# EAGLE design controller (EAGLE 9.6.2)
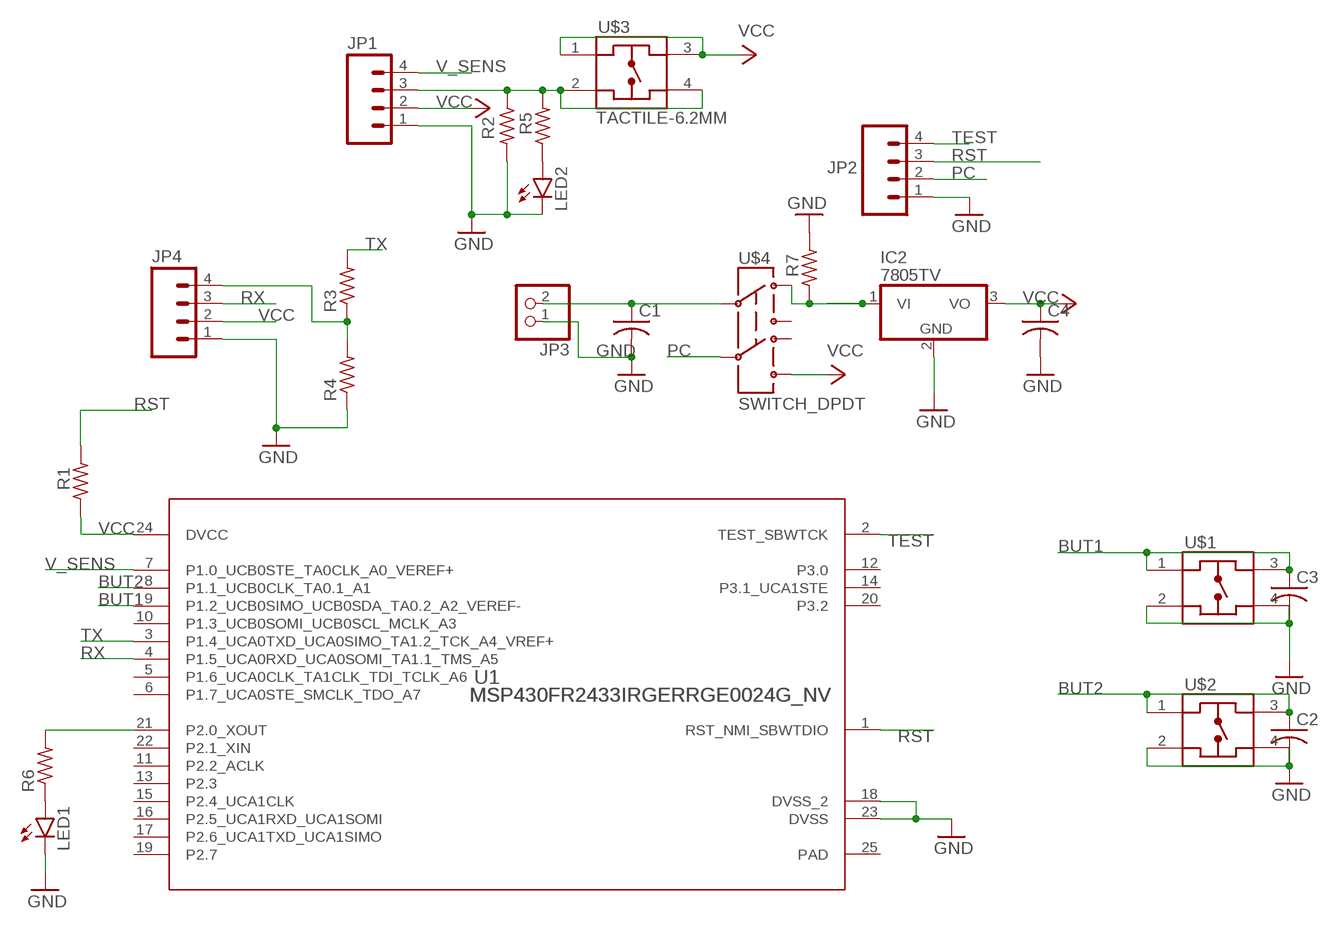
[diagram p0: schematic, sheet 1]

## Parts
C1  C-USC1206  [C1206]
C2  C-USC0603  [C0603]
C3  C-USC0603  [C0603]
C4  C-USC1206  [C1206]
IC2  7805TV  [TO220V]
JP1  HEADER_1X04LOCK  [1X04_LOCK]
JP2  HEADER_1X04LOCK  [1X04_LOCK]
JP3  PINHD-1X2  [1X02]
JP4  HEADER_1X04LOCK  [1X04_LOCK]
LED1  LED5MM  [LED5MM]
LED2  LED5MM  [LED5MM]
R1  R-US_R1206  [R1206]
R2  R-US_R1206  [R1206]
R3  R-US_R1206  [R1206]
R4  R-US_R1206  [R1206]
R5  R-US_R1206  [R1206]
R6  R-US_R1206  [R1206]
R7  R-US_R1206  [R1206]
U1  MSP430FR2433IRGERRGE0024G_NV  [RGE0024G_NV]
U$1  TACTILE-6.2MM  [222_AM]
U$2  TACTILE-6.2MM  [222_AM]
U$3  TACTILE-6.2MM  [222_AM]
U$4  SWITCH_DPDT  [JS_DPDT_TH]

## Nets
BUT1: C3.1 U1.9(P1.2_UCB0SIMO_UCB0SDA_TA0.2_A2_VEREF-) U$1.1 U$1.3
BUT2: C2.1 U1.8(P1.1_UCB0CLK_TA0.1_A1) U$2.1 U$2.3
GND: C1.2 C2.2 C3.2 C4.2 IC2.2(GND) JP1.1 JP2.1 JP3.1 JP4.1 LED1.K(C) LED2.K(C) R2.2 R4.1 R7.2 U1.18(DVSS_2) U1.23(DVSS) U$1.2 U$1.4 U$2.2 U$2.4
N$1: IC2.1(VI) R7.1 U$4.1
N$2: R6.2 U1.21(P2.0_XOUT)
N$3: C1.1 JP3.2 U$4.2
N$4: JP1.3 R2.1 R5.2 U$3.2 U$3.4
N$7: LED1.A R6.1
N$8: JP4.4 R3.1 R4.2
N$9: LED2.A R5.1
PC: JP2.2 U$4.5
RST: JP2.3 R1.2 U1.1(RST_NMI_SBWTDIO)
RX: JP4.3 U1.4(P1.5_UCA0RXD_UCA0SOMI_TA1.1_TMS_A5)
TEST: JP2.4 U1.2(TEST_SBWTCK)
TX: R3.2 U1.3(P1.4_UCA0TXD_UCA0SIMO_TA1.2_TCK_A4_VREF+)
V_SENS: JP1.4 U1.7(P1.0_UCB0STE_TA0CLK_A0_VEREF+)
VCC: C4.1 IC2.3(VO) JP1.2 JP4.2 R1.1 U1.24(DVCC) U$3.1 U$3.3 U$4.6
Unconnected: U1.5(P1.6_UCA0CLK_TA1CLK_TDI_TCLK_A6) U1.6(P1.7_UCA0STE_SMCLK_TDO_A7) U1.10(P1.3_UCB0SOMI_UCB0SCL_MCLK_A3) U1.11(P2.2_ACLK) U1.12(P3.0) U1.13(P2.3) U1.14(P3.1_UCA1STE) U1.15(P2.4_UCA1CLK) U1.16(P2.5_UCA1RXD_UCA1SOMI) U1.17(P2.6_UCA1TXD_UCA1SIMO) U1.19(P2.7) U1.20(P3.2) U1.22(P2.1_XIN) U$4.3 U$4.4

## Power pins joined to a net without a drawn wire
PAD: U1.25(PAD)

## Library data of the parts
C1-C4 = rcl:C-US: CAPACITOR, American symbol; SPICEPREFIX: C
IC2 = linear:78*: Positive VOLTAGE REGULATOR Source: http://cache.national.com/ds/LM/LM78L05.pdf http://www.fairchildsemi.com/ds/LM/LM7805.pdf
JP1 JP2 JP4 = ELEC327:HEADER_1X04: Header 4 Standard 4-pin 0.1" header. Use with straight break away headers (SKU : PRT-00116), right angle break away headers (PRT-00553), swiss pins (PRT-00743), machine pins (PRT-00117), and female headers (PRT-00115). Molex polarized connector foot print use with SKU : PRT-08231 with associated crimp pins and housings.
JP3 = pinhead:PINHD-1X2: PIN HEADER
LED1 LED2 = led:LED: LED OSRAM: - CHIPLED LG R971, LG N971, LY N971, LG Q971, LY Q971, LO R971, LY R971 LH N974, LH R974 LS Q976, LO Q976, LY Q976 LO Q996 - Hyper CHIPLED LW Q18S LB Q993, LB Q99A, LB R99A - SideLED LS A670, LO A670, LY A670, LG A670, LP A670 LB A673, LV A673, LT A673, LW A673 LH A674 LY A675 LS A676, LA A676, LO A676, LY A676, LW A676 LS A679, LY A679, LG A679 - Hyper Micro SIDELED® LS Y876, LA Y876, LO Y876, LY Y876 LT Y87S - SmartLED LW L88C, LW L88S LB L89C, LB L89S, LG L890 LS L89K, LO L89K, LY L89K LS L896, LA L896, LO L896, LY L896 - TOPLED LS T670, LO T670, LY T670, LG T670, LP T670 LSG T670, LSP T670, LSY T670, LOP T670, LYG T670 LG T671, LOG T671, LSG T671 LB T673, LV T673, LT T673, LW T673 LH T674 LS T676, LA T676, LO T676, LY T676, LB T676, LH T676, LSB T676, LW T676 LB T67C, LV T67C, LT T67C, LS T67K, LO T67K, LY T67K, LW E67C LS E67B, LA E67B, LO E67B, LY E67B, LB E67C, LV E67C, LT E67C LW T67C LS T679, LY T679, LG T679 LS T770, LO T770, LY T770, LG T770, LP T770 LB T773, LV T773, LT T773, LW T773 LH T774 LS E675, LA E675, LY E675, LS T675 LS T776, LA T776, LO T776, LY T776, LB T776 LHGB T686 LT T68C, LB T68C - Hyper Mini TOPLED® LB M676 - Mini TOPLED Santana® LG M470 LS M47K, LO M47K, LY M47K Source: http://www.osram.convergy.de LUXEON: - LUMILED® LXK2-PW12-R00, LXK2-PW12-S00, LXK2-PW14-U00, LXK2-PW14-V00 LXK2-PM12-R00, LXK2-PM12-S00, LXK2-PM14-U00 LXK2-PE12-Q00, LXK2-PE12-R00, LXK2-PE12-S00, LXK2-PE14-T00, LXK2-PE14-U00 LXK2-PB12-K00, LXK2-PB12-L00, LXK2-PB12-M00, LXK2-PB14-N00, LXK2-PB14-P00, LXK2-PB14-Q00 LXK2-PR12-L00, LXK2-PR12-M00, LXK2-PR14-Q00, LXK2-PR14-R00 LXK2-PD12-Q00, LXK2-PD12-R00, LXK2-PD12-S00 LXK2-PH12-R00, LXK2-PH12-S00 LXK2-PL12-P00, LXK2-PL12-Q00, LXK2-PL12-R00 Source: www.luxeon.com KINGBRIGHT: KA-3528ASYC Source: www.kingbright.com
R1-R7 = rcl:R-US_: RESISTOR, American symbol; SPICEPREFIX: R
U1 = msp430fr2433:MSP430FR2433IRGER; COPYRIGHT: Copyright (C) 2023 Ultra Librarian. All rights reserved.; MANUFACTURER_PART_NUMBER: MSP430FR2433IRGER; MFR_NAME: Texas Instruments; REFDES: RefDes; TYPE: TYPE
U$1-U$3 = ELEC327:TACTILE-6.2MM: CTS 6.2 x 6.2 mm Tactile Switch CTS Part Number 222AMVBAR (SMD) Digikey part CT3088TR-ND
U$4 = ELEC327:SWITCH_DPDT

## Board
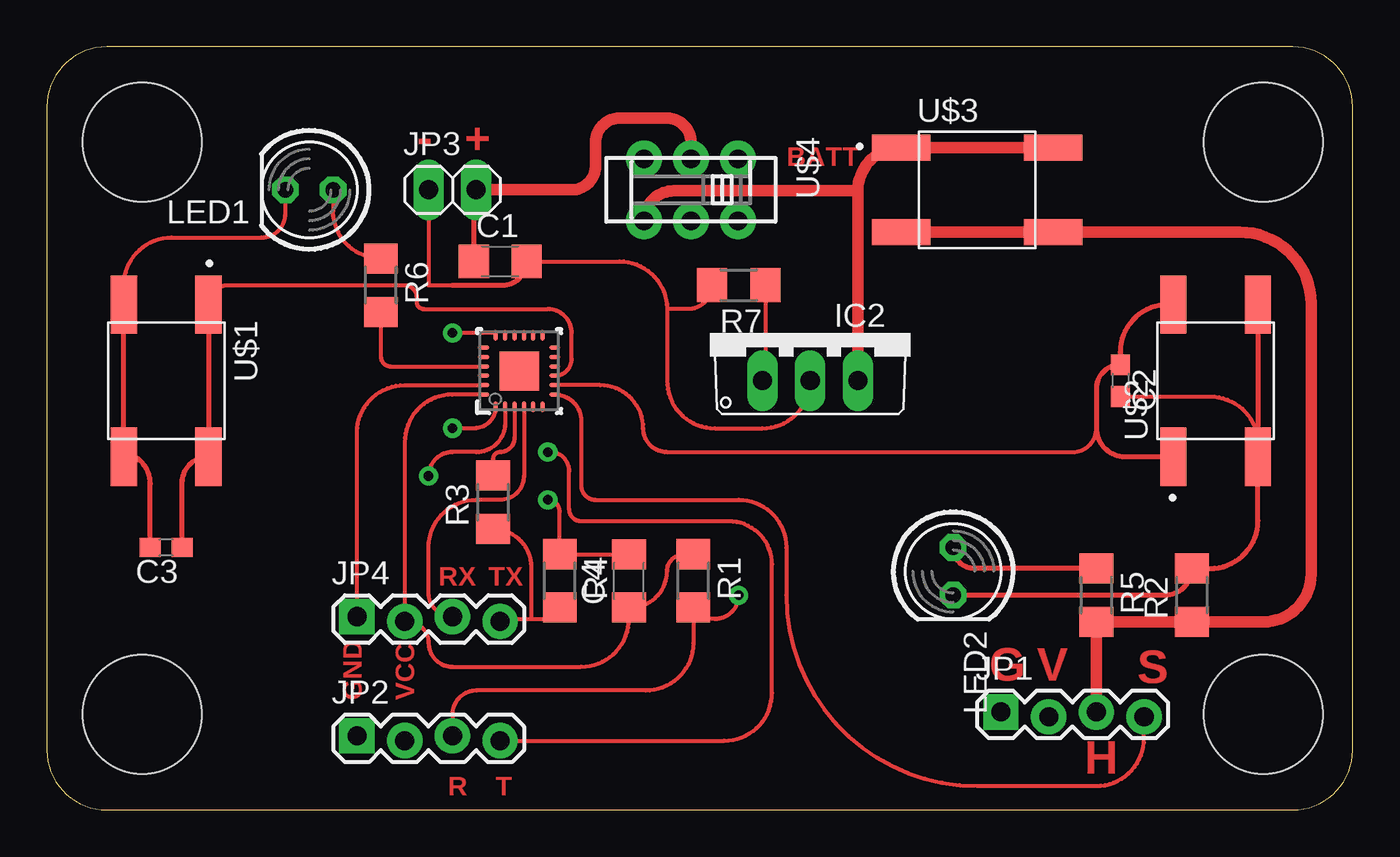
[diagram p1: board, top side]
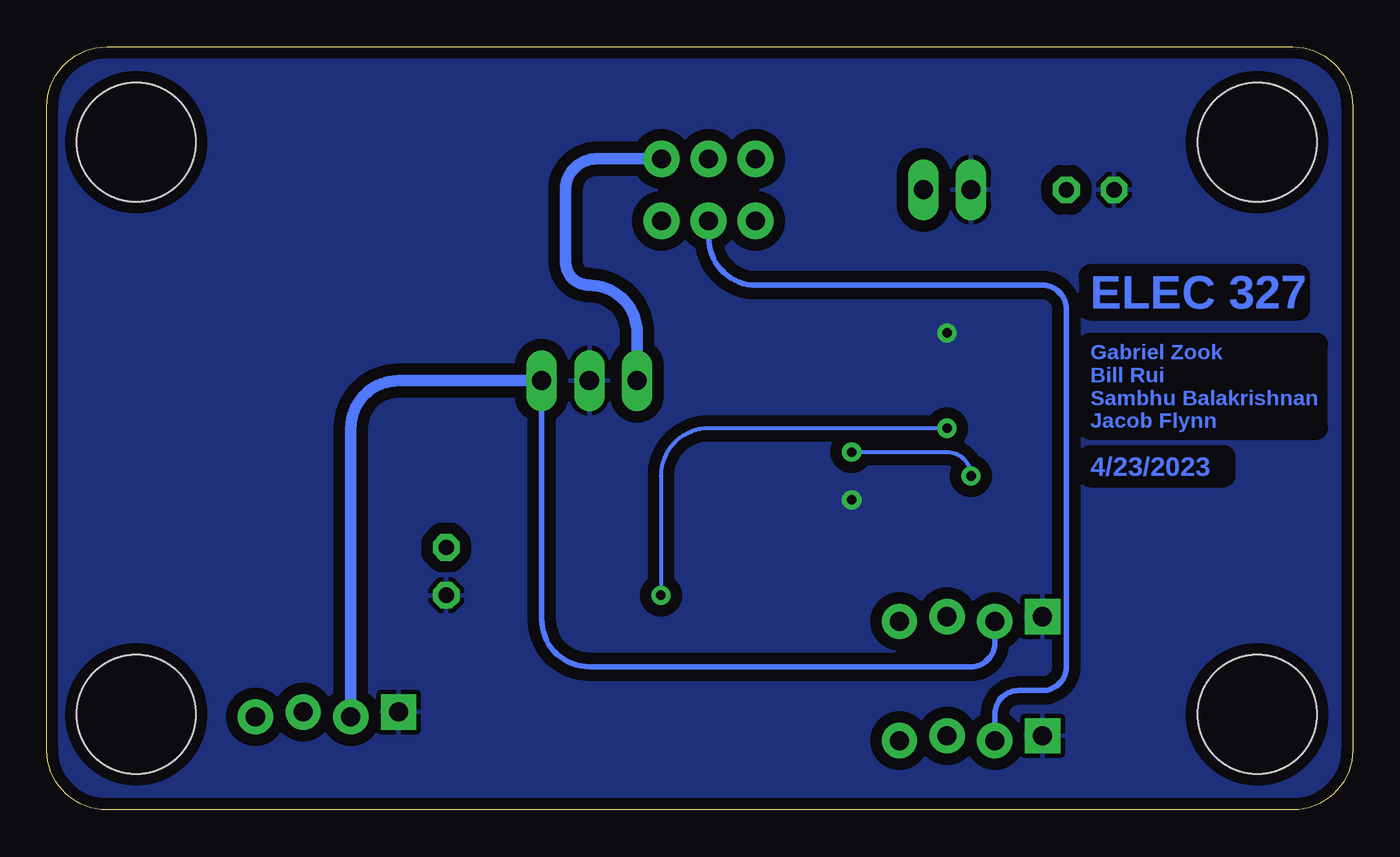
[diagram p2: board, bottom side, seen from below]

Size 69.52 x 40.63 mm. Coordinates in mm from the lower left corner, seen from the top.
Outline: 0,37.45 0,3.17 arc90 3.17,0 66.34,0 arc90 69.52,3.17 69.52,37.45 arc90 66.34,40.63 3.17,40.63 arc90 0,37.45
Copper layers (1*16): Top 0.035mm / dielectric 1.5mm / Bottom 0.035mm
Design rules "AdvancedCircuitsBarebones": minimum track width 6mil, minimum drill 20mil, track to track 6mil, track to pad 6mil, pad to pad 6mil, via to via 6mil, smd to smd 6mil, copper to edge 10mil, drill to drill 6mil, minimum pad ring 12mil, minimum via ring 10mil, stop-mask expansion 4mil, vias tented up to drill 25mil, thermal gap 10mil
Holes 6.35 mm at 5.08,5.08 5.08,35.56 64.77,35.56 64.77,5.08

### Footprints (pad centres in the part's own frame; a part is rotated, then mirrored left to right if it is on the bottom)
C1206 = smd 1.6 x 1.8: 1 -1.4,0; 2 1.4,0
C0603 = smd 1.1 x 1: 1 -0.85,0; 2 0.85,0
TO220V = drill 1.016 long: 1 -2.54,-2.54; 2 0,-2.54; 3 2.54,-2.54
1X04_LOCK = drill 1.016 pad 1.88 square: 1 0,0.127 | drill 1.016 pad 1.88: 2 2.54,-0.127; 3 5.08,0.127; 4 7.62,-0.127
1X02 = drill 1.016 long: 1 -1.27,0; 2 1.27,0
LED5MM = drill 0.813 octagon: A -1.27,0; K 1.27,0
R1206 = smd 1.6 x 1.803: 1 -1.422,0; 2 1.422,0
RGE0024G_NV = smd 0.6 x 0.24: 1 -1.9,1.25; 2 -1.9,0.75; 3 -1.9,0.25; 4 -1.9,-0.25; 5 -1.9,-0.75; 6 -1.9,-1.25; 13 1.9,-1.25; 14 1.9,-0.75; 15 1.9,-0.25; 16 1.9,0.25; 17 1.9,0.75; 18 1.9,1.25 | smd 0.24 x 0.6: 7 -1.25,-1.9; 8 -0.75,-1.9; 9 -0.25,-1.9; 10 0.25,-1.9; 11 0.75,-1.9; 12 1.25,-1.9; 19 1.25,1.9; 20 0.75,1.9; 21 0.25,1.9; 22 -0.25,1.9; 23 -0.75,1.9; 24 -1.25,1.9 | smd 2.1 x 2.1: 25 0,0
222_AM = smd 3.1 x 1.4: 1 -4.05,2.25; 2 -4.05,-2.25; 3 4.05,2.25; 4 4.05,-2.25
JS_DPDT_TH = drill 1 pad 1.93: 1 -2.5,-1.65; 2 0,-1.65; 3 2.5,-1.65; 4 -2.5,1.65; 5 0,1.65; 6 2.5,1.65

### Placement (x,y rotation side)
C1  24.13,29.21 0 top
C2  57.15,22.86 270 top
C3  6.35,13.97 180 top
C4  30.99,12.19 90 top
IC2  40.64,25.4 0 top
JP1  50.8,5.08 0 top
JP2  16.51,3.81 0 top
JP3  21.59,33.02 0 top
JP4  16.51,10.16 0 top
LED1  13.97,33.02 180 top
LED2  48.26,12.7 270 top
R1  34.42,12.19 270 top
R2  60.96,11.43 90 top
R3  23.75,16.38 90 top
R4  27.3,12.19 270 top
R5  55.88,11.43 270 top
R6  17.78,27.94 270 top
R7  36.83,27.94 180 top
U1  25.15,23.37 90 top
U$1  6.35,22.86 270 top
U$2  62.23,22.86 90 top
U$3  49.53,33.02 0 top
U$4  34.29,33.02 180 top

### Tracks (layer width: path | path; a pad name or v marks a point on that pad's centre or on a via)
BUT1
  Top 0.203: U$1.1 arc-90 9.63,27.94 19.05,27.94 arc-90 19.68,27.3 19.68,27.05 arc90 20.07,26.67 26.67,26.67 arc-90 27.94,25.4 27.94,24.01 arc-90 U1.9
  Top 0.254: C3.1 7.2,17.41 arc-90 U$1.3 U$1.1
BUT2
  Top 0.203: 55.88,20.32 arc-90 54.61,19.05 33.02,19.05 arc-90 31.75,20.32 arc90 29.45,22.62 U1.8
  Top 0.254: U$2.3 59.69,26.91 arc90 57.15,24.37 C2.1 arc90 55.88,22.44 55.88,20.32 arc90 57.39,18.81 U$2.1
GND  (via drill 0.51)
  Top 0.203: C2.2 61.94,22.01 arc-90 64.48,19.47 | JP3.1 20.32,27.94 21.59,27.94 | C1.2 30.48,29.21 arc-90 33.02,26.67 | IC2.2 arc-90 38.1,20.32 35.56,20.32 arc-90 33.02,22.86 33.02,26.67 | 26.67,14.25 arc90 R4.1 | U$1.2 4.1,27.94 arc-90 6.64,30.48 11.43,30.48 arc90 12.7,31.75 LED1.K | U1.18 arc90 23.76,25.4 v21.59,25.4 | R4.1 30.97,13.61 arc-90 C4.2 | R4.1 27.3,15.88 arc90 v26.67,16.51 | JP4.1 16.51,20.08 arc-90 19.05,22.62 U1.23 | R7.2 arc-90 34.14,26.67 33.02,26.67
  Top 0.254: U$2.2 64.48,15.39 arc-90 61.94,12.85 R2.2 arc-90 59.54,11.43 LED2.K | U$2.4 64.48,19.47 64.48,19.05 | U$1.4 U$1.2 | C3.2 5.5,17.36 arc90 3.81,19.05 | 21.59,27.94 24.26,27.94 arc90 C1.2
  Top 0.305: R4.1 27.3,14.14
  Top 0.61: 64.48,19.05 U$2.2 64.48,19.47 | U$1.4 4.05,18.81 arc-90 3.81,19.05
  pour Bottom (isolate 0.61, rank 4): 69.85,1.19 69.85,37.47 arc90 66.67,40.64 3.17,40.64 arc90 0,37.47 0,0 68.66,0
N$1
  Top 0.203: R7.1 38.25,23.01 arc-90 IC2.1
  Bottom 0.61: IC2.1 38.1,25.4 arc-90 40.64,27.94 arc90 41.91,29.21 41.91,33.02 arc90 40.26,34.67 U$4.1
N$2
  Top 0.203: R6.2 17.78,24.13 arc90 18.29,23.62 U1.21
N$3
  Top 0.254: JP3.2 arc-90 22.73,32.89 C1.1
  Top 0.61: JP3.2 27.94,33.02 arc90 29.21,34.29 29.21,35.56 arc-90 30.48,36.83 33.02,36.83 arc-90 34.29,35.56 U$4.2
N$4
  Top 0.61: U$3.2 U$3.4 63.5,30.77 arc-90 67.31,26.96 67.31,12.55 arc-90 64.77,10.01 R2.1 R5.2 JP1.3
N$7
  Top 0.203: LED1.A 15.24,31.9 arc90 R6.1
N$8
  Top 0.203: JP4.4 arc-90 24.26,10.16 25.78,10.16 | R4.2 arc-90 26.7,10.16 25.78,10.16 | R3.1 arc-90 25.78,12.93 25.78,10.16
N$9
  Top 0.254: R5.1 49.38,12.85 arc-90 LED2.A
PC
  Bottom 0.305: U$4.5 34.29,30.48 arc-90 31.75,27.94 16.51,27.94 arc90 15.24,26.67 15.24,7.62 arc90 16.51,6.35 17.78,6.35 arc-90 19.05,5.08 JP2.2
RST  (via drill 0.51)
  Top 0.203: R1.2 34.42,10.16 | 34.42,10.16 34.42,8.89 arc-90 31.88,6.35 22.86,6.35 arc90 21.59,5.08 JP2.3 | U1.1 arc-90 22.75,20.32 v21.59,20.32 | v36.83,11.43 arc-90 35.56,10.16 34.42,10.16
  Bottom 0.203: v21.59,20.32 34.29,20.32 arc-90 36.83,17.78 v36.83,11.43
RX
  Top 0.203: U1.4 25.4,17.78 arc-90 24.13,16.51 22.86,16.51 arc90 20.32,13.97 20.32,11.56 arc90 JP4.3
TEST  (via drill 0.51)
  Top 0.203: JP2.4 36.07,3.68 arc90 38.61,6.22 38.61,13.08 arc90 36.32,15.37 28.45,15.37 arc-90 27.81,16 27.81,18.03 arc90 26.8,19.05 v26.67,19.05 | U1.2 24.4,20.59 arc-90 22.86,19.05 21.59,19.05 arc90 v20.32,17.78
  Bottom 0.203: v20.32,17.78 arc-90 21.59,19.05 v26.67,19.05
TX
  Top 0.203: U1.3 24.9,19.82 arc-90 24.13,19.05 arc90 23.75,18.67 R3.2
V_SENS
  Top 0.203: JP1.4 58.42,3.81 arc-90 55.88,1.27 49.53,1.27 arc-90 39.37,11.43 39.37,13.97 arc90 36.83,16.51 29.21,16.51 arc-90 28.45,17.27 28.45,20.72 arc90 U1.7
VCC
  Top 0.203: U1.24 21.59,22.12 arc90 19.05,19.58 JP4.2 19.18,10.03 arc-90 20.32,8.89 arc90 21.59,7.62 28.45,7.62 arc90 30.99,10.16 C4.1 31.11,10.79 arc90 33.02,12.7 arc-90 33.93,13.61 R1.1
  Top 0.61: 43.18,32.97 arc-90 U$3.1 U$3.3 | 43.18,32.97 IC2.3 | U$4.6 arc-90 33.39,32.97 43.18,32.97
  Bottom 0.305: JP4.2 19.05,8.89 arc90 20.32,7.62 40.64,7.62 arc90 43.18,10.16 IC2.3
  Bottom 0.61: IC2.3 50.8,22.86 arc-90 53.34,20.32 JP1.2

### Text on the board
Top: - | + | BATT | RX | TX | G | V | S | GND | VCC | H | R | T
Bottom: ELEC 327 | Gabriel Zook / Bill Rui / Sambhu Balakrishnan / Jacob Flynn | 4/23/2023